# EAGLE schematic nedo1800 (EAGLE 5.01)
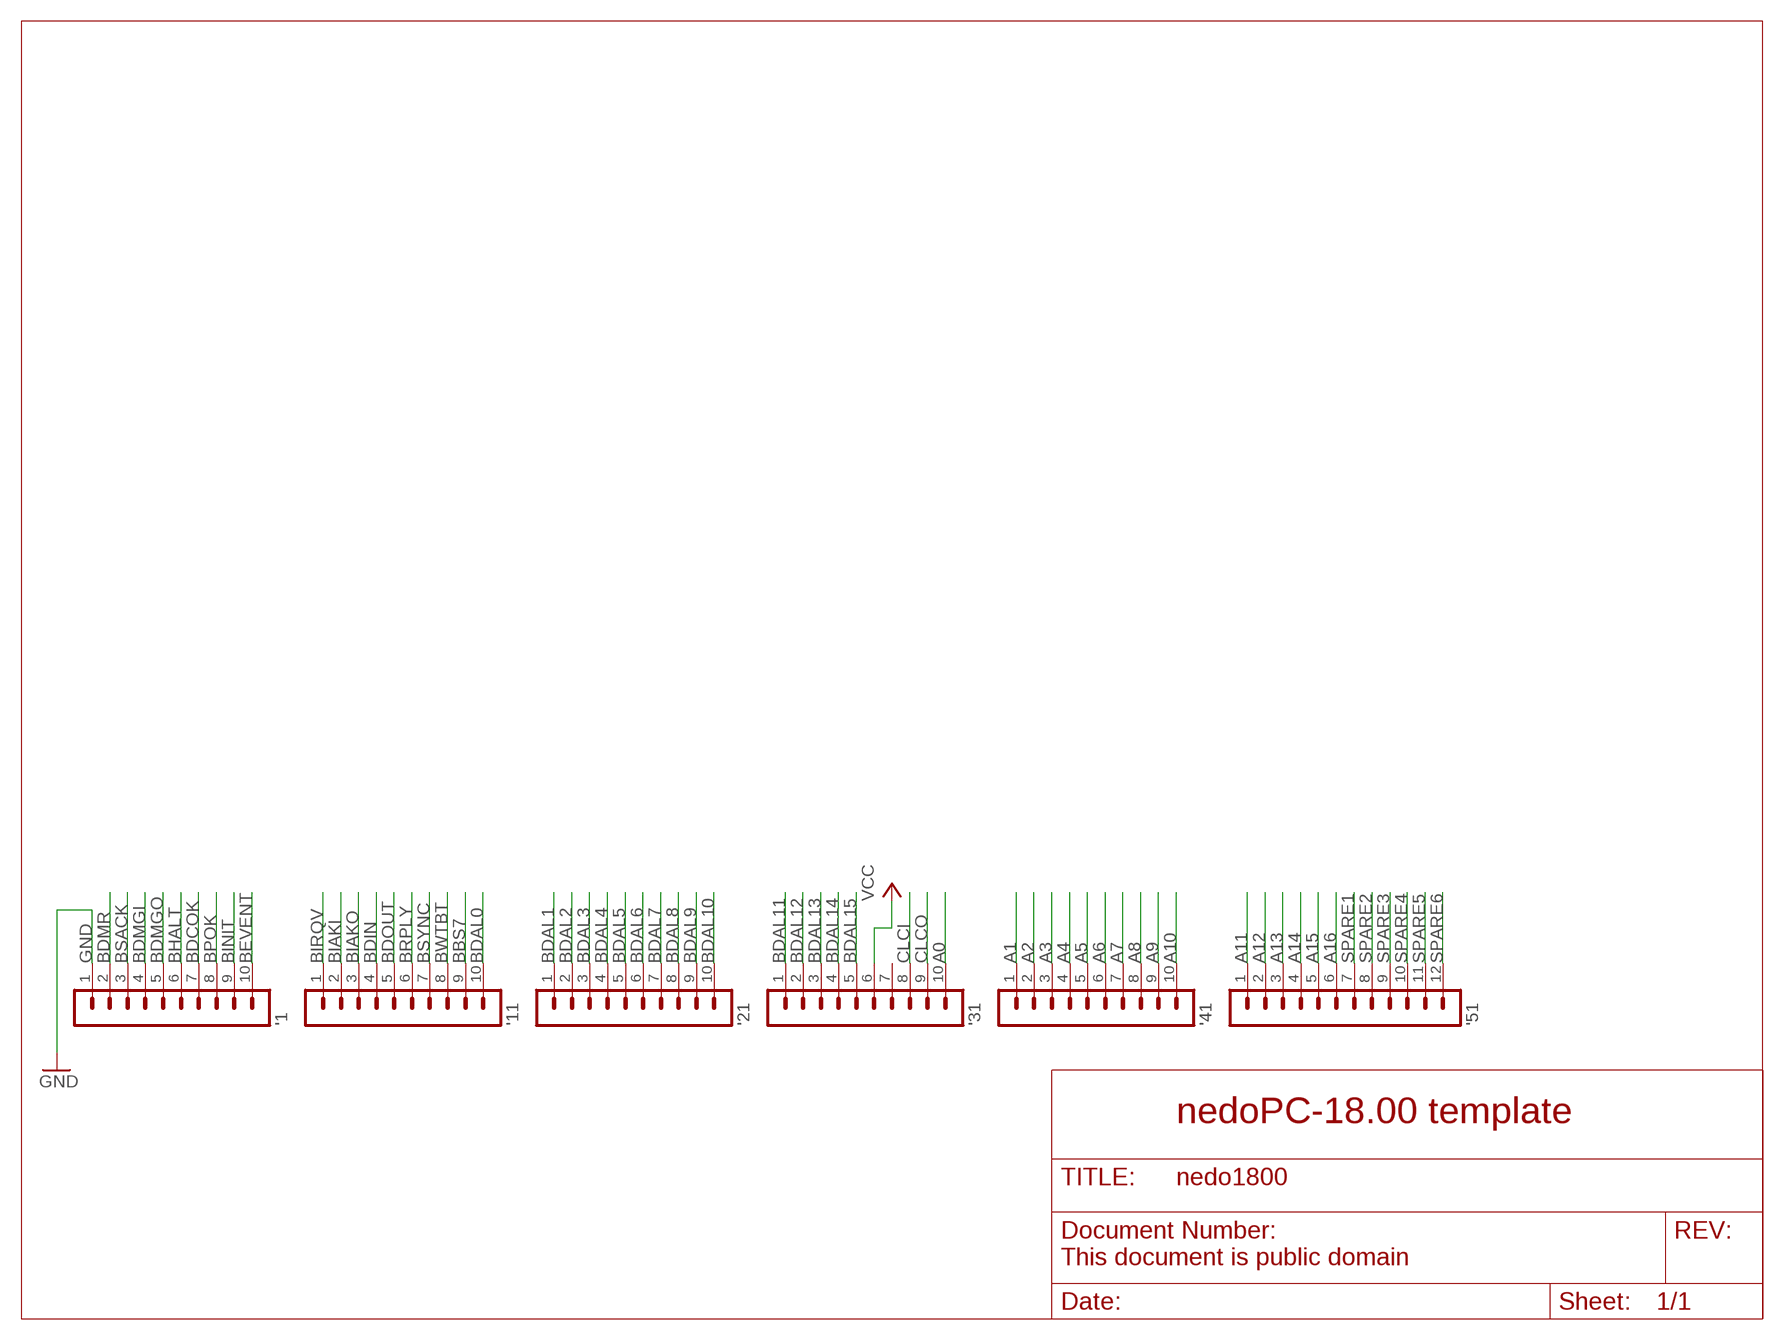
[diagram p0: schematic, sheet 1]

## Parts
'1  MA10-1  [MA10-1]
'11  MA10-1  [MA10-1]
'21  MA10-1  [MA10-1]
'31  MA10-1  [MA10-1]
'41  MA10-1  [MA10-1]
'51  MA12-1  [MA12-1]

## Nets
A0: '31.10
A1: '41.1
A2: '41.2
A3: '41.3
A4: '41.4
A5: '41.5
A6: '41.6
A7: '41.7
A8: '41.8
A9: '41.9
A10: '41.10
A11: '51.1
A12: '51.2
A13: '51.3
A14: '51.4
A15: '51.5
A16: '51.6
BBS7: '11.9
BDAL0: '11.10
BDAL1: '21.1
BDAL2: '21.2
BDAL3: '21.3
BDAL4: '21.4
BDAL5: '21.5
BDAL6: '21.6
BDAL7: '21.7
BDAL8: '21.8
BDAL9: '21.9
BDAL10: '21.10
BDAL11: '31.1
BDAL12: '31.2
BDAL13: '31.3
BDAL14: '31.4
BDAL15: '31.5
BDCOK: '1.7
BDIN: '11.4
BDMGI: '1.4
BDMGO: '1.5
BDMR: '1.2
BDOUT: '11.5
BEVENT: '1.10
BHALT: '1.6
BIAKI: '11.2
BIAKO: '11.3
BINIT: '1.9
BIRQV: '11.1
BPOK: '1.8
BRPLY: '11.6
BSACK: '1.3
BSYNC: '11.7
BWTBT: '11.8
CLCI: '31.8
CLCO: '31.9
GND: '1.1
SPARE1: '51.7
SPARE2: '51.8
SPARE3: '51.9
SPARE4: '51.10
SPARE5: '51.11
SPARE6: '51.12
VCC: '31.6
Unconnected: '31.7

## Notes on the sheet
- nedoPC-18.00 template
- This document is public domain

## Library data of the parts
'1 '11 '21 '31 '41 = con-lstb:MA10-1: PIN HEADER
'51 = con-lstb:MA12-1: PIN HEADER